# EasyEDA schematic SCH_PHOENIX - PCB-1 .json
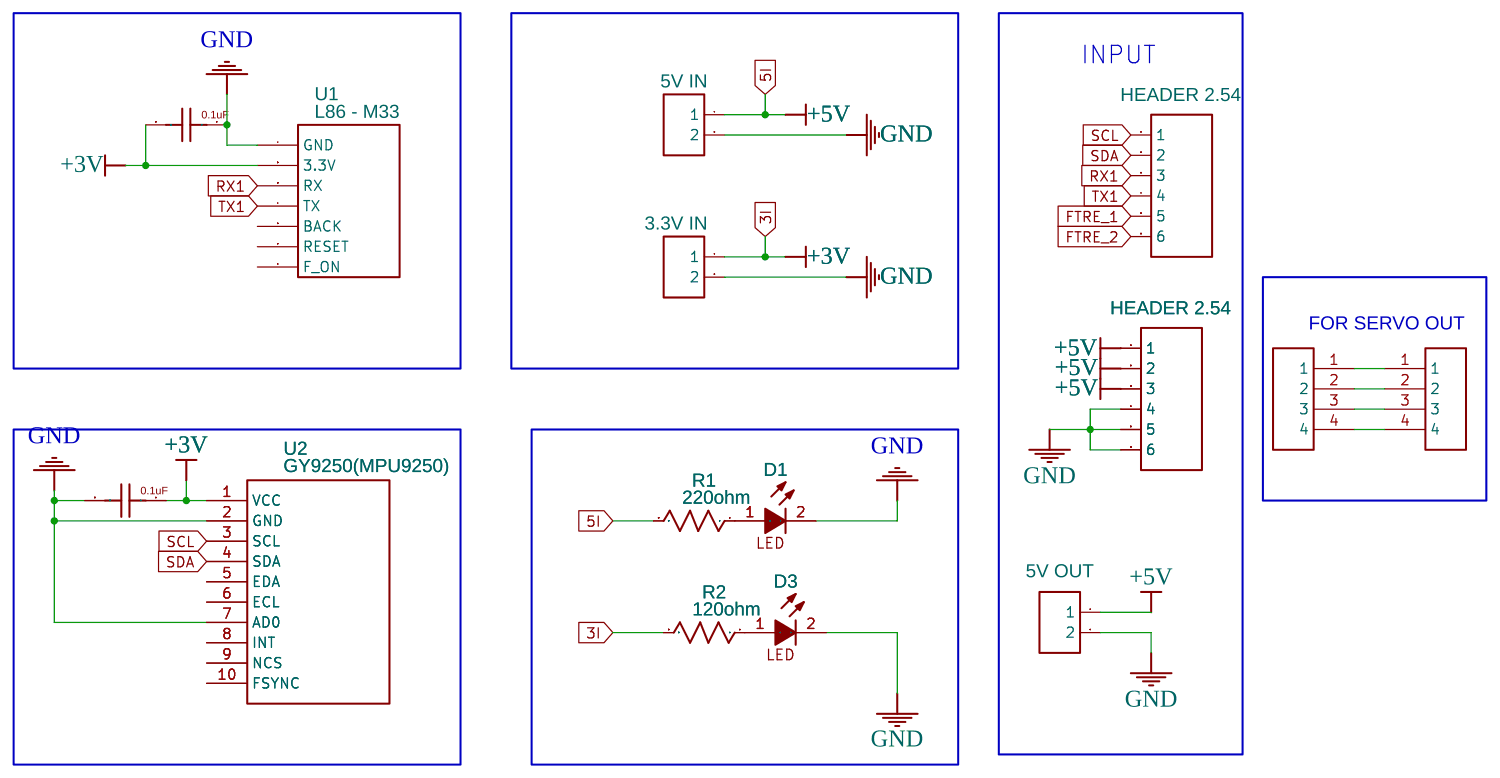
[diagram p0: schematic sheet]

## Parts
C1  22PF CERAMIC CAPACITOR  [GENCERAMICCAPACITOR]
C4  22PF CERAMIC CAPACITOR  [GENCERAMICCAPACITOR]
D1  LED  [LED-TH_LED-DP2-2LED-AMCC]
D3  LED  [LED-TH_LED-DP2-2LED-AMCC]
H1  FOR SERVO OUT  [B2B 2.54 MM HEADER]
H2  FOR SERVO OUT  [B2B 2.54 MM HEADER]
IN  5V IN  [CONN-TH_2P-P5.00]
IN1  5V OUT  [CONN-TH_2P-P5.00]
J1  HEADER 2.54  [HDR-TH_6PIN-V-MALE-PITCH2.54]
J2  HEADER 2.54  [HDR-TH_6PIN-V-MALE-PITCH2.54]
P1  3.3V IN  [CONN-TH_2P-P5.00]
R1  220ohm  [RESISTOR TH]
R2  120ohm  [RESISTOR TH]
U1  L86 - M33  [L86-M33 GPS]
U2  GY9250(MPU9250)  [GY9250(MPU9250)]

## Library data of the parts
C1 C4 = 22PF CERAMIC CAPACITOR: Contributor: Giann De Leon
D1 D3 = LED: Supplier: Digi-Key; Manufacturer: VccLite; Manufacturer Part: 5600; Supplier Part: L20325-ND; link: https://vcclite.com/product/5602f5-5v/; Contributor: brandonmeza
H1 H2 = B2B 2.54 MM HEADER: Manufacturer: MULTICOMP PRO; Manufacturer Part: 2211S-04G; Supplier Part: 1593413; Supplier: Element14; link: https://au.element14.com/multicomp/2211s-03g/header-1-row-vert-3way/dp/1593412?st=2211S-03G; Contributor: alexandriamckie
IN IN1 P1 = CONN-TH_2P-P5.00: Supplier: LCSC; Contributor: LCEDA_Lib
J1 = HEADER-MALE-2.54_1X6: Manufacturer Part: 2.54mm 1*20PHeader; image: //image.lceda.cn/szlcsc/C50981.jpg; Contributor: Kitchacircuit
J2 = HEADER-MALE-2.54_1X6: Manufacturer Part: 2.54mm 1*20PHeader; image: //image.lceda.cn/szlcsc/C50981.jpg; Contributor: Kitchacircuit; Package Display: No
R1 R2 = R_0603_US: Contributor: LCEDA_Lib
U1 = BMP280 COPY: Contributor: Calibre320
U2 = GY9250(MPU9250): Contributor: aequitas

## Nets
+3V: C1.2 C4.1 P1.1 R2.2 U1.6(3.3V) U2.1(VCC)
+5V: IN.1 IN1.1 J2.1 J2.2 J2.3 R1.2
GND: C1.1 C4.2 D1.2(K) D3.2(K) IN.2 IN1.2 J2.4 J2.5 J2.6 P1.2 U1.7(GND) U2.2(GND) U2.7(AD0)
FTRE_1: J1.5
FTRE_2: J1.6
RX1: J1.3 U1.5(RX)
SCL: J1.1 U2.3(SCL)
SDA: J1.2 U2.4(SDA)
TX1: J1.4 U1.4(TX)
Net-(D1-1): D1.1(A) R1.1
Net-(D3-1): D3.1(A) R2.1
Net-(H1-1): H1.1 H2.1
Net-(H1-2): H1.2 H2.2
Net-(H1-3): H1.3 H2.3
Net-(H1-4): H1.4 H2.4

Not connected (* = marked no-connect by the designer): U1 1(F_ON) 2(RESET) 3(BACK); U2 5(EDA) 6(ECL) 8(INT) 9(NCS) 10(FSYNC)

## Notes on the sheet
- INPUT
- FOR SERVO OUT
